# Altium schematic sheet EDU_High-Speed-Design_IO.SchDoc: IO
size 279 x 215 mm; Date: not used; ApprovedBy: not used; CheckedBy: not used; Author: not used; DrawnBy: not used; Organization: not used; Address4: not used; SheetNumber: 6; SheetTotal: 6; Time: not used; ImagePath: not used; Application_BuildNumber: not used
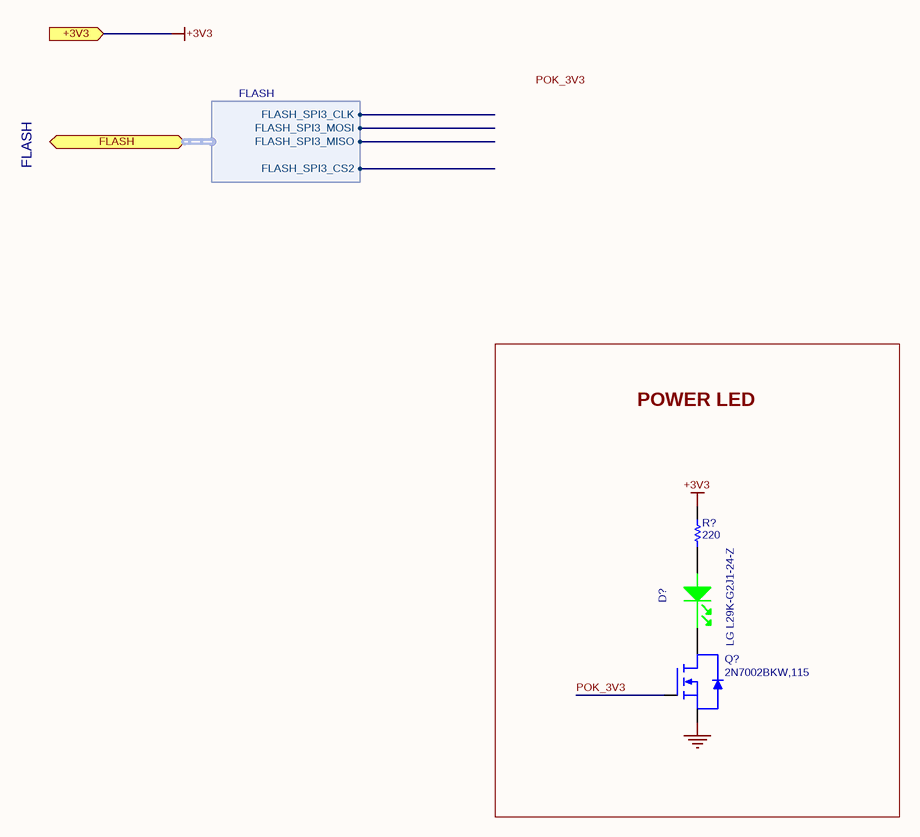
[diagram p0: EDU_High-Speed-Design_IO.SchDoc]

## Parts
D?  LG L29K-G2J1-24-Z  [LED_0603_GREEN]
Q?  2N7002BKW,115  [SOT-23-3]
R?  220  [R0402]

## Blocks framed on the sheet
POWER LED: D? Q? R?

## Ports
+3V3 (in), FLASH (bidir, harness FLASH)

## Harnesses
FLASH: FLASH_SPI3_CLK, FLASH_SPI3_MISO, FLASH_SPI3_CS2, FLASH_SPI3_MOSI

## Nets
+3V3: R?.1 ; port +3V3
GND: Q?.2(S)
POK_3V3: Q?.1(G)
NetD?_1: D?.1(cathode) Q?.3(D)
NetD?_2: D?.2(ANODE) R?.2

## Notes on the sheet
- FLASH
- Labels drawn without touching a wire or pin: POK_3V3
- Title:
- Date:
- Size A
- Project:
- Time:
- Sheet
- Revision
- of
- Engineer:
- File:

## Library data of the parts
D? = LG L29K-G2J1-24-Z: LED SMARTLED GREEN 570NM 0603; Manufacturer 1: OSRAM Opto Semiconductors Inc; Manufacturer Part Number 1: LG L29K-G2J1-24-Z; Supplier 1: Digi-Key; Supplier Part Number 1: 475-2709-1-ND
Q? = 2N7002BKW,115: MOSFET N-CH 60V 310MA SOT323; Manufacturer 1: NXP Semiconductors; Supplier 1: Digi-Key; Supplier Part Number 1: 568-5980-1-ND; Manufacturer Part Number 1: 2N7002BKW,115; ComponentLink1URL: http://www.nxp.com/documents/data_sheet/2N7002BKW.pdf; ComponentLink1Description: http://www.nxp.com/documents/data_sheet/2N7002BKW.pdf
R? = RC0402FR-07220RL: RES 220 OHM 1/16W 1% 0402 SMD; Manufacturer 1: Yageo; Manufacturer Part Number 1: RC0402FR-07220RL; Resistance: 220; Supplier 1: Digi-Key; Supplier Part Number 1: 311-220LRCT-ND; ComponentLink1URL: http://www.yageo.com/documents/recent/PYu-RC0402_51_RoHS_L_6.pdf; ComponentLink1Description: http://www.yageo.com/documents/recent/PYu-RC0402_51_RoHS_L_6.pdf